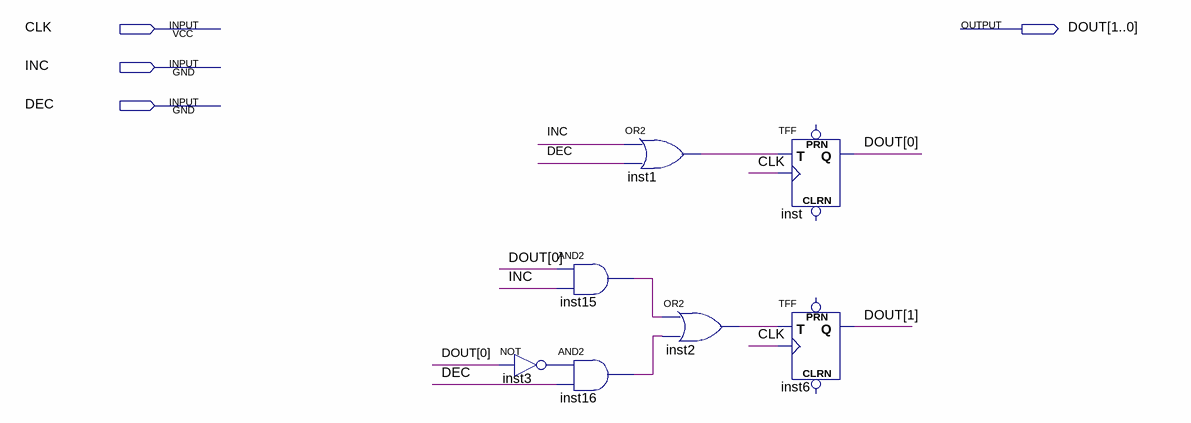
[diagram p0: schematic sheet]
// Quartus schematic REG2_INC_DEC.bdf as structural Verilog: 7 symbols, 4 pins
module REG2_INC_DEC (
  input  CLK,
  input  INC,
  input  DEC,
  output [1:0] DOUT
);

  wire inst1_out, inst2_out, inst3_out, inst15_out, inst16_out;

  not inst3 (inst3_out, DOUT[0]);
  or inst1 (inst1_out, INC, DEC);
  and inst15 (inst15_out, DOUT[0], INC);
  and inst16 (inst16_out, inst3_out, DEC);
  or inst2 (inst2_out, inst15_out, inst16_out);
  TFF inst (.T(inst1_out), .CLK(CLK), .Q(DOUT[0]));  // open: PRN, CLRN
  TFF inst6 (.T(inst2_out), .CLK(CLK), .Q(DOUT[1]));  // open: PRN, CLRN
endmodule
